# Altium schematic sheet Interposer.SchDoc: Connectors - Frontend
size A4; Date: 28.09.2023; ApprovedBy: M.Sc. Tobias Wirth; CheckedBy: M.Sc. Tobias Wirth; Author: M.Sc. Tobias Wirth; CompanyName: University of Stuttgart; DrawnBy: M.Sc. Tobias Wirth; Engineer: M.Sc. Tobias Wirth; Organization: IIS; Address1: Pfaffenwaldring 47; Address2: 70569 Stuttgart; Revision: V1.2; SheetNumber: 5; SheetTotal: 11; ProjectNameAlt: AUS - NMR System; Time: 13:40; ImagePath: N/A; Application_BuildNumber: N/A
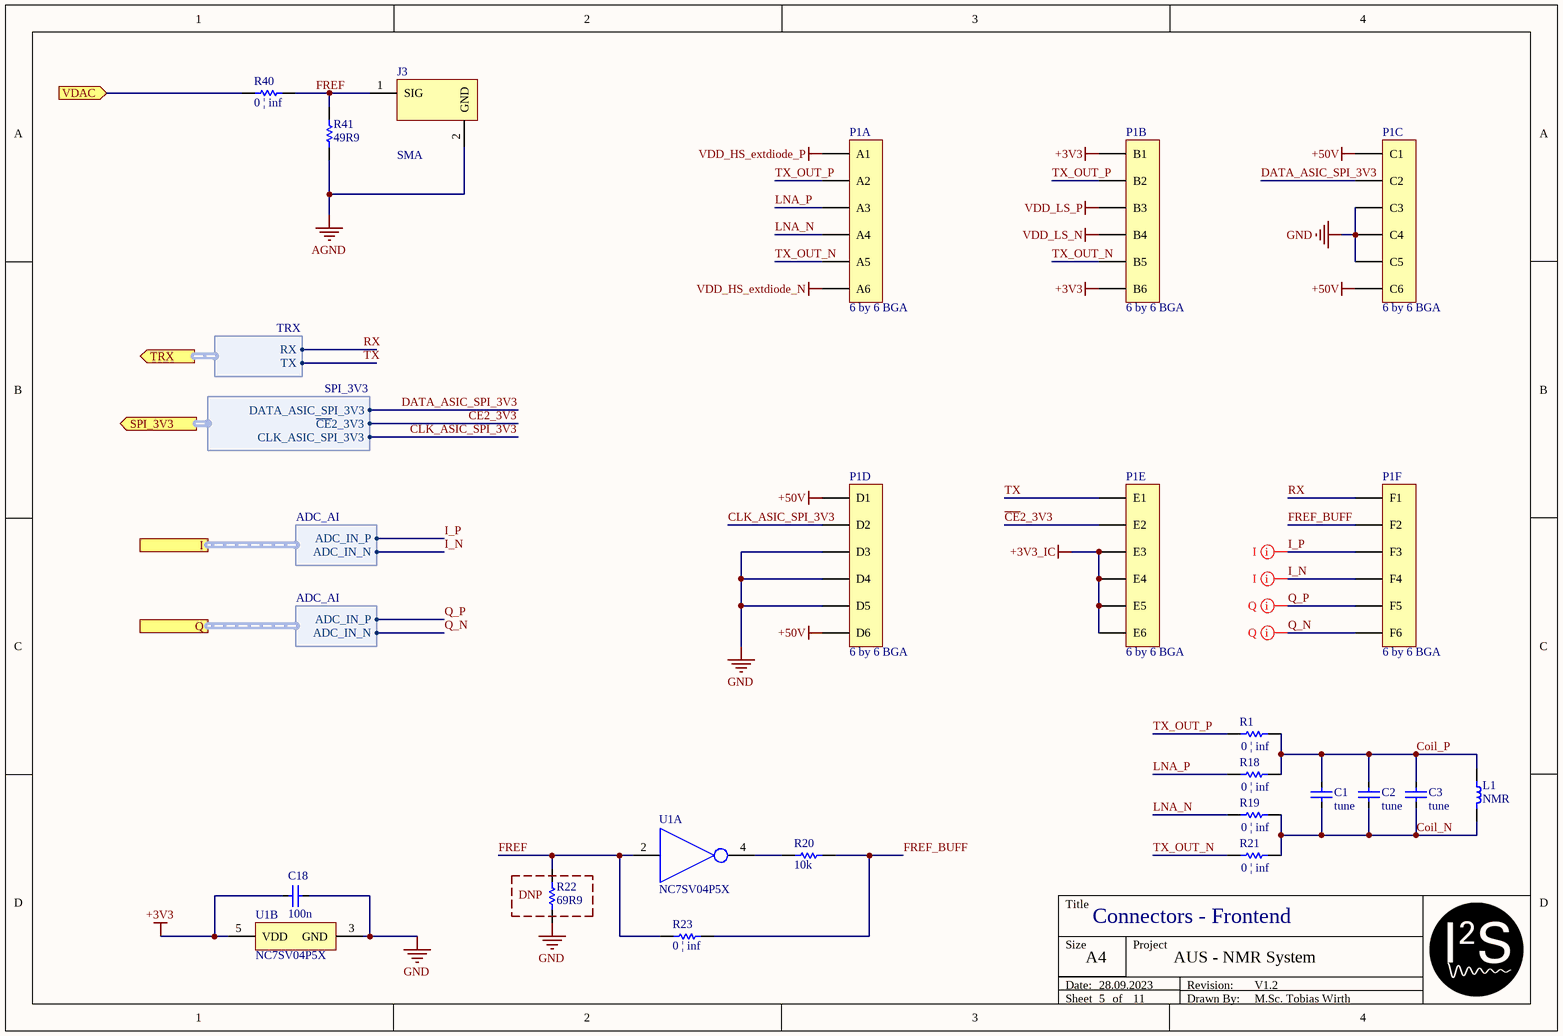
[diagram p0: Interposer.SchDoc]

## Parts
C1  tune  [CAP_1206]
C2  tune  [CAP_0805]
C3  tune  [CAP_0603]
C18  100n  [CAP_0402]
J3  SMA  [SMA]
L1  NMR  [NMR-Coil-Pads]
P1  6 by 6 BGA  [BGA36C230P6X6_1500X1500X190 - Interposer]  (parts A,B,C,D,E,F of 6)
R1  0 | inf  [RES_0402]
R18  0 | inf  [RES_0402]
R19  0 | inf  [RES_0402]
R20  10k  [RES_0402]
R21  0 | inf  [RES_0402]
R22  69R9  [RES_0603]
R23  value 0 | inf  [RES_0402]
R40  0 | inf  [RES_0402]
R41  49R9  [RES_0402]
U1  NC7SV04P5X  [SOT23-65P210X110-5N]  (parts A,B of 2)

## Blocks framed on the sheet
DNP: R22

## Ports
I (harness ADC_AI), Q (harness ADC_AI), SPI_3V3 (out, harness SPI_3V3), TRX (out, harness TRX), VDAC (in)

## Harnesses
TRX: TX, RX
SPI_3V3: DATA_ASIC_SPI_3V3, ~{CE}2_3V3, CLK_ASIC_SPI_3V3
ADC_AI: ADC_IN_P, ADC_IN_N

## Nets
+3V3: C18.1 P1.B1 P1.B6 U1.5(VDD)
+3V3_IC: P1.E3 P1.E4 P1.E5 P1.E6
+50V: P1.C1 P1.C6 P1.D1 P1.D6
AGND: J3.2(GND) R41.1
GND: C18.2 P1.C3 P1.C4 P1.C5 P1.D3 P1.D4 P1.D5 R22.1 U1.3(GND)
VDD_HS_extdiode_N: P1.A6
VDD_HS_extdiode_P: P1.A1
VDD_LS_N: P1.B4
VDD_LS_P: P1.B3
~{CE}2_3V3: P1.E2 ; port SPI_3V3.~{CE}2_3V3
CLK_ASIC_SPI_3V3: P1.D2 ; port SPI_3V3.CLK_ASIC_SPI_3V3
Coil_N: C1.2 C2.2 C3.2 L1.2 R19.1 R21.1
Coil_P: C1.1 C2.1 C3.1 L1.1 R1.1 R18.1
DATA_ASIC_SPI_3V3: P1.C2 ; port SPI_3V3.DATA_ASIC_SPI_3V3
FREF: J3.1(SIG) R22.2 R23.2 R40.2 R41.2 U1.2
FREF_BUFF: P1.F2 R20.2 R23.1
I_N: P1.F4 ; port I.ADC_IN_N
I_P: P1.F3 ; port I.ADC_IN_P
LNA_N: P1.A4 R19.2
LNA_P: P1.A3 R18.2
Q_N: P1.F6 ; port Q.ADC_IN_N
Q_P: P1.F5 ; port Q.ADC_IN_P
RX: P1.F1 ; port TRX.RX
TX: P1.E1 ; port TRX.TX
TX_OUT_N: P1.A5 P1.B5 R21.2
TX_OUT_P: P1.A2 P1.B2 R1.2
VDAC: R40.1 ; port VDAC
NetR20_1: R20.1 U1.4

## Layout directives
differential pair; differential pair class IQ; net class IQ: I_N, I_P, Q_N, Q_P

## Notes on the sheet
- Title
- Size
- Date:
- Sheet
- A4
- of
- Project
- Drawn By:
- Revision:

## Library data of the parts
C1-C3 C18 = Cap: Supplier: *; Part Number: *
  C1-C3: Value: tune
  C18: Value: 100n
L1 = Ind: Part Number: *; Supplier: *; Value: NMR
P1 = BGA_6x6
R1 R18-R23 R40 R41 = Res: Part Number: *; Supplier: *
  R1 R18 R19 R21 R40: Value: 0 | inf
  R20: Value: 10k
  R22: Value: 69R9
  R41: Value: 49R9